# EAGLE schematic tiny-psu-exp-v1.1 (EAGLE 9.6.2)

## Sheet 1 of 2
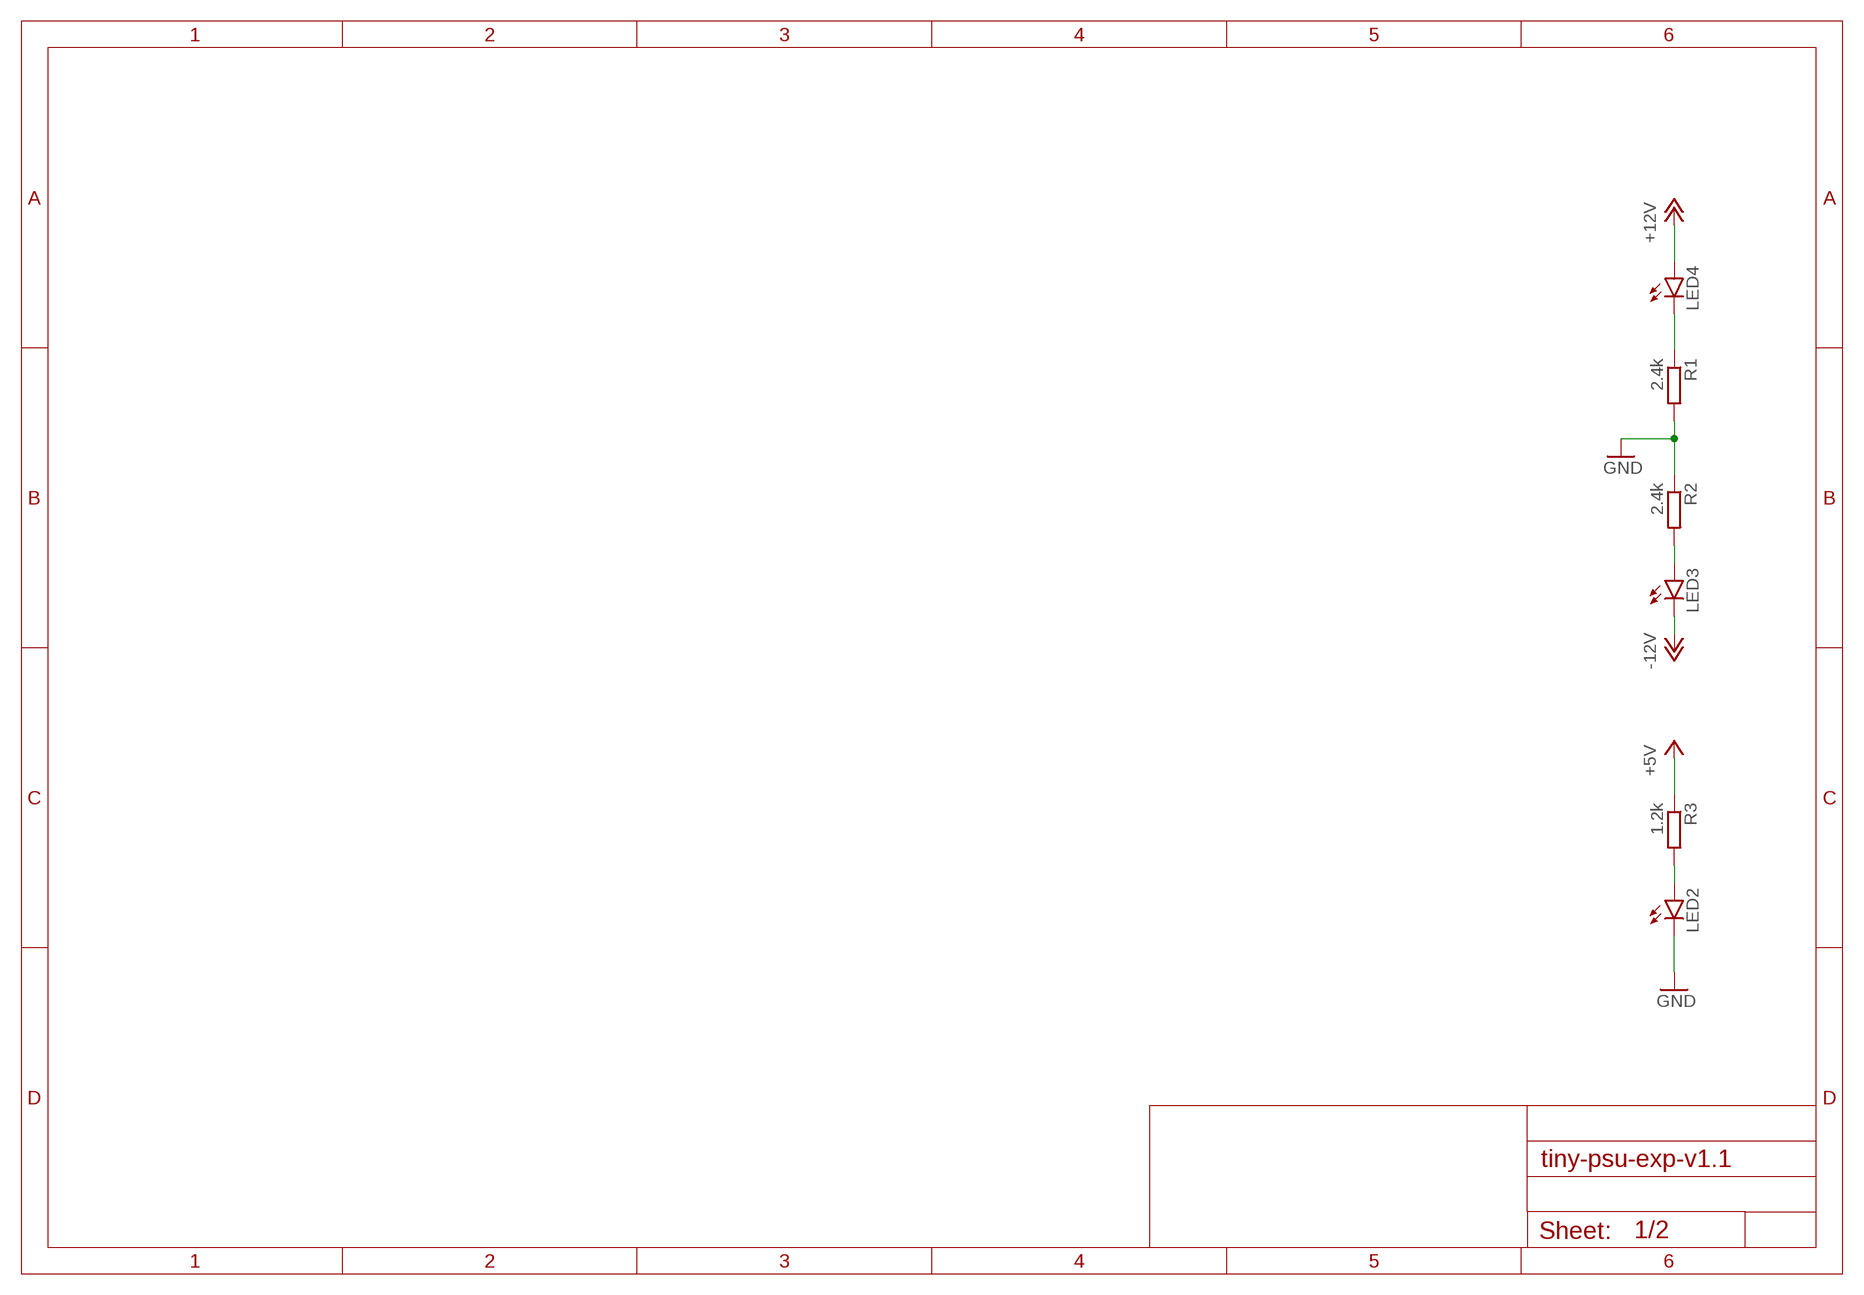
[diagram p0: schematic, sheet 1]

### Parts
LED2  LEDCHIP-LED0805  [CHIP-LED0805]
LED3  LEDCHIP-LED0805  [CHIP-LED0805]
LED4  LEDCHIP-LED0805  [CHIP-LED0805]
R1  2.4k  R-EU_R0805  [R0805]
R2  2.4k  R-EU_R0805  [R0805]
R3  1.2k  R-EU_R0805  [R0805]

### Nets
+5V: R3.1 ; also sheet 2
+12V: LED4.A ; also sheet 2
-12V: LED3.C ; also sheet 2
GND: LED2.C R1.2 R2.1 ; also sheet 2
N$1: LED4.C R1.1
N$3: LED3.A R2.2
N$10: LED2.A R3.2

## Sheet 2 of 2
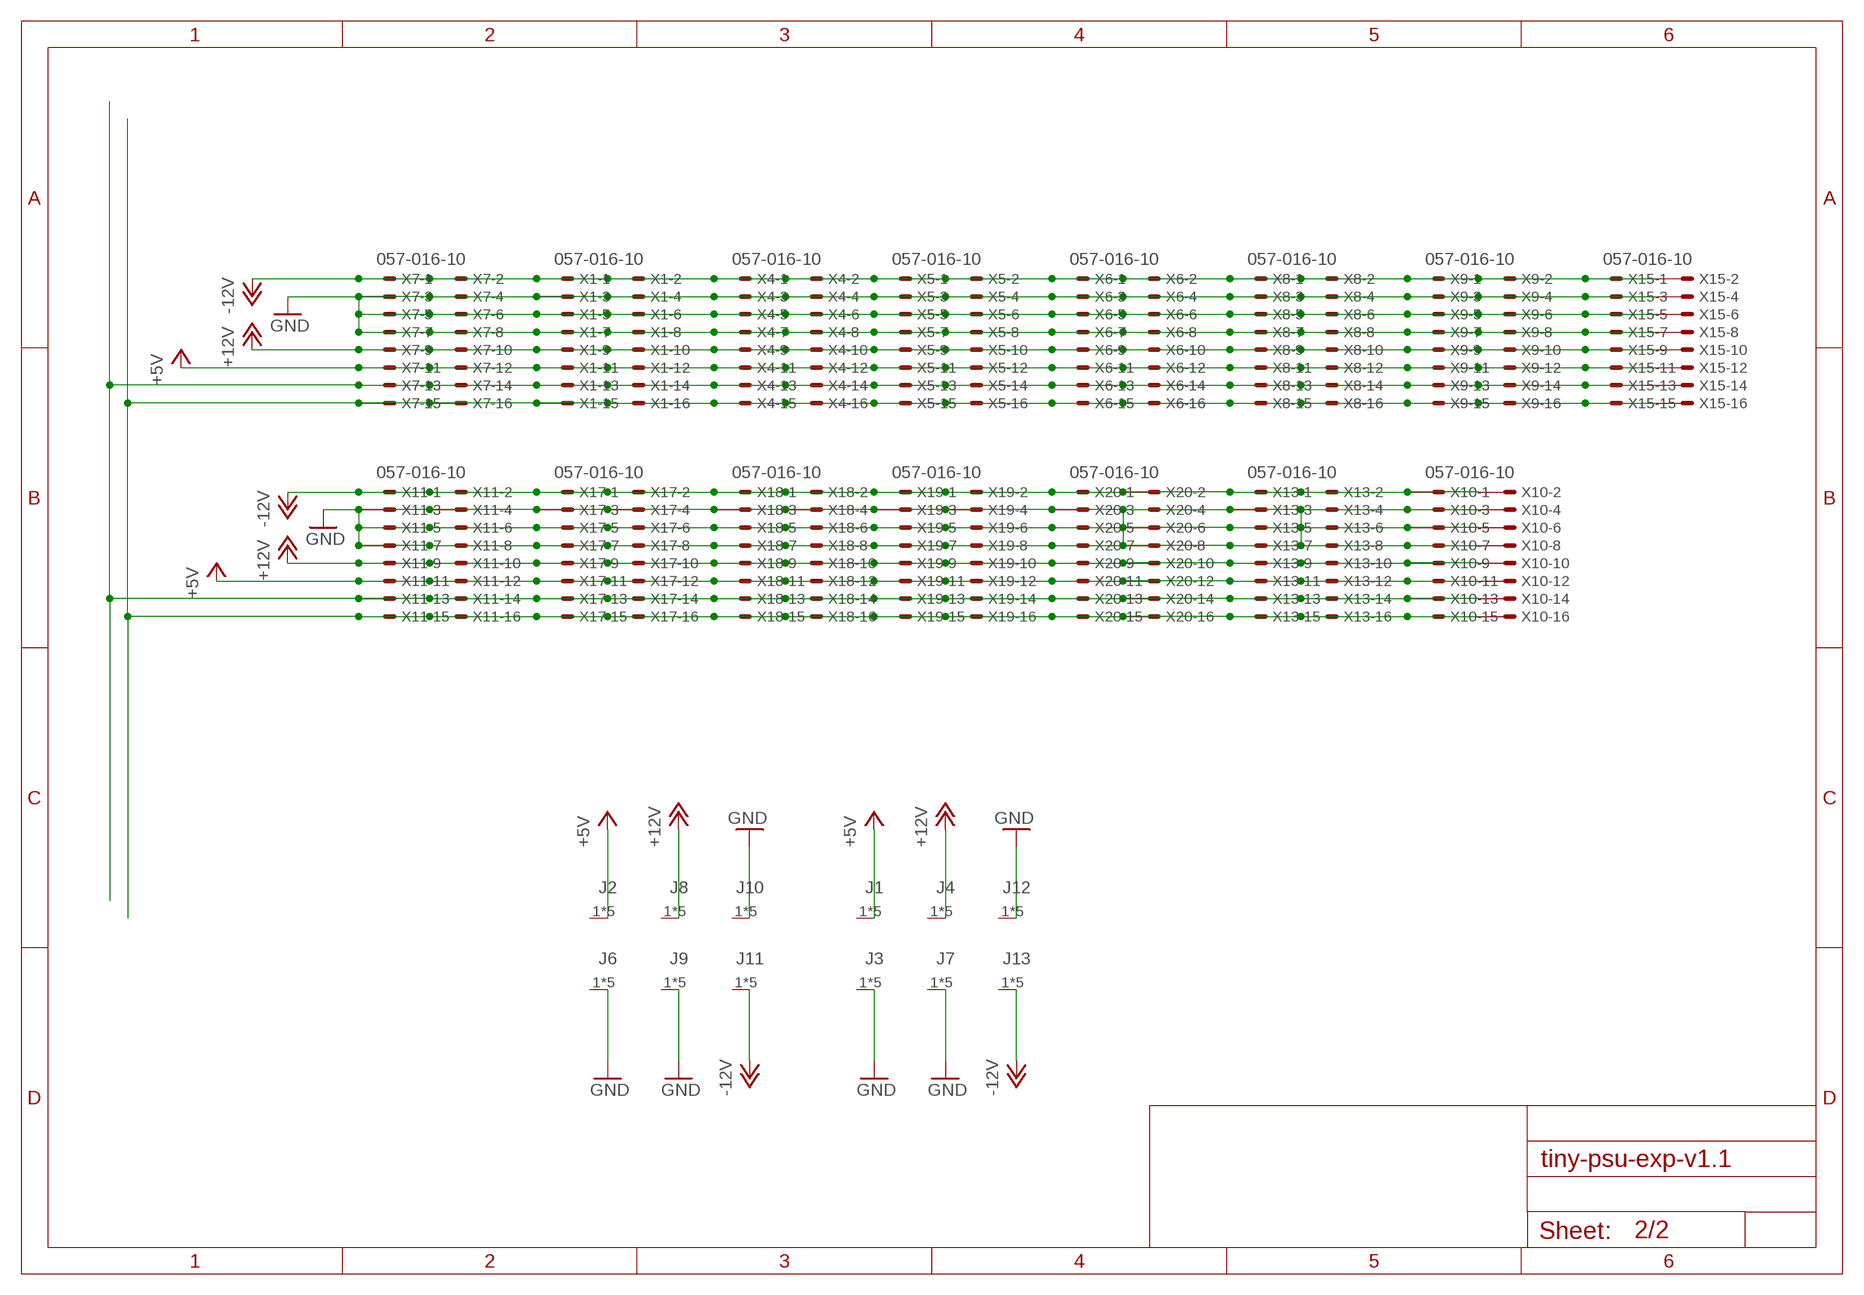
[diagram p1: schematic, sheet 2]

### Parts
J1  30A-SCREW-CONN  [50X72]
J2  30A-SCREW-CONN  [50X72]
J3  30A-SCREW-CONN  [50X72]
J4  30A-SCREW-CONN  [50X72]
J6  30A-SCREW-CONN  [50X72]
J7  30A-SCREW-CONN  [50X72]
J8  30A-SCREW-CONN  [50X72]
J9  30A-SCREW-CONN  [50X72]
J10  30A-SCREW-CONN  [50X72]
J11  30A-SCREW-CONN  [50X72]
J12  30A-SCREW-CONN  [50X72]
J13  30A-SCREW-CONN  [50X72]
X1  057-016-10  [057-016-1]
X4  057-016-10  [057-016-1]
X5  057-016-10  [057-016-1]
X6  057-016-10  [057-016-1]
X7  057-016-10  [057-016-1]
X8  057-016-10  [057-016-1]
X9  057-016-10  [057-016-1]
X10  057-016-10  [057-016-1]
X11  057-016-10  [057-016-1]
X13  057-016-10  [057-016-1]
X15  057-016-10  [057-016-1]
X17  057-016-10  [057-016-1]
X18  057-016-10  [057-016-1]
X19  057-016-10  [057-016-1]
X20  057-016-10  [057-016-1]

### Nets
+5V: J1.1 J1.2 J1.3 J1.4 J1.P$1 J2.1 J2.2 J2.3 J2.4 J2.P$1 X1.11 X1.12 X4.11 X4.12 X5.11 X5.12 X6.11 X6.12 X7.11 X7.12 X8.11 X8.12 X9.11 X9.12 X10.11 X10.12 X11.11 X11.12 X13.11 X13.12 X15.11 X15.12 X17.11 X17.12 X18.11 X18.12 X19.11 X19.12 X20.11 X20.12 ; also sheet 1
+12V: J4.1 J4.2 J4.3 J4.4 J4.P$1 J8.1 J8.2 J8.3 J8.4 J8.P$1 X1.9 X1.10 X4.9 X4.10 X5.9 X5.10 X6.9 X6.10 X7.9 X7.10 X8.9 X8.10 X9.9 X9.10 X10.9 X10.10 X11.9 X11.10 X13.9 X13.10 X15.9 X15.10 X17.9 X17.10 X18.9 X18.10 X19.9 X19.10 X20.9 X20.10 ; also sheet 1
-12V: J11.1 J11.2 J11.3 J11.4 J11.P$1 J13.1 J13.2 J13.3 J13.4 J13.P$1 X1.1 X1.2 X4.1 X4.2 X5.1 X5.2 X6.1 X6.2 X7.1 X7.2 X8.1 X8.2 X9.1 X9.2 X10.1 X10.2 X11.1 X11.2 X13.1 X13.2 X15.1 X15.2 X17.1 X17.2 X18.1 X18.2 X19.1 X19.2 X20.1 X20.2 ; also sheet 1
CV1: X1.13 X1.14 X4.13 X4.14 X5.13 X5.14 X6.13 X6.14 X7.13 X7.14 X8.13 X8.14 X9.13 X9.14 X10.13 X10.14 X11.13 X11.14 X13.13 X13.14 X15.13 X15.14 X17.13 X17.14 X18.13 X18.14 X19.13 X19.14 X20.13 X20.14
GATE1: X1.15 X1.16 X4.15 X4.16 X5.15 X5.16 X6.15 X6.16 X7.15 X7.16 X8.15 X8.16 X9.15 X9.16 X10.15 X10.16 X11.15 X11.16 X13.15 X13.16 X15.15 X15.16 X17.15 X17.16 X18.15 X18.16 X19.15 X19.16 X20.15 X20.16
GND: J3.1 J3.2 J3.3 J3.4 J3.P$1 J6.1 J6.2 J6.3 J6.4 J6.P$1 J7.1 J7.2 J7.3 J7.4 J7.P$1 J9.1 J9.2 J9.3 J9.4 J9.P$1 J10.1 J10.2 J10.3 J10.4 J10.P$1 J12.1 J12.2 J12.3 J12.4 J12.P$1 X1.3 X1.4 X1.5 X1.6 X1.7 X1.8 X4.3 X4.4 X4.5 X4.6 X4.7 X4.8 X5.3 X5.4 X5.5 X5.6 X5.7 X5.8 X6.3 X6.4 X6.5 X6.6 X6.7 X6.8 X7.3 X7.4 X7.5 X7.6 X7.7 X7.8 X8.3 X8.4 X8.5 X8.6 X8.7 X8.8 X9.3 X9.4 X9.5 X9.6 X9.7 X9.8 X10.3 X10.4 X10.5 X10.6 X10.7 X10.8 X11.3 X11.4 X11.5 X11.6 X11.7 X11.8 X13.3 X13.4 X13.5 X13.6 X13.7 X13.8 X15.3 X15.4 X15.5 X15.6 X15.7 X15.8 X17.3 X17.4 X17.5 X17.6 X17.7 X17.8 X18.3 X18.4 X18.5 X18.6 X18.7 X18.8 X19.3 X19.4 X19.5 X19.6 X19.7 X19.8 X20.3 X20.4 X20.5 X20.6 X20.7 X20.8 ; also sheet 1

## Library data of the parts
J1-J4 J6-J13 = conn-screw:30A-SCREW-CONN
LED2-LED4 = led:LED: LED OSRAM: - CHIPLED LG R971, LG N971, LY N971, LG Q971, LY Q971, LO R971, LY R971 LH N974, LH R974 LS Q976, LO Q976, LY Q976 LO Q996 - Hyper CHIPLED LW Q18S LB Q993, LB Q99A, LB R99A - SideLED LS A670, LO A670, LY A670, LG A670, LP A670 LB A673, LV A673, LT A673, LW A673 LH A674 LY A675 LS A676, LA A676, LO A676, LY A676, LW A676 LS A679, LY A679, LG A679 - Hyper Micro SIDELED® LS Y876, LA Y876, LO Y876, LY Y876 LT Y87S - SmartLED LW L88C, LW L88S LB L89C, LB L89S, LG L890 LS L89K, LO L89K, LY L89K LS L896, LA L896, LO L896, LY L896 - TOPLED LS T670, LO T670, LY T670, LG T670, LP T670 LSG T670, LSP T670, LSY T670, LOP T670, LYG T670 LG T671, LOG T671, LSG T671 LB T673, LV T673, LT T673, LW T673 LH T674 LS T676, LA T676, LO T676, LY T676, LB T676, LH T676, LSB T676, LW T676 LB T67C, LV T67C, LT T67C, LS T67K, LO T67K, LY T67K, LW E67C LS E67B, LA E67B, LO E67B, LY E67B, LB E67C, LV E67C, LT E67C LW T67C LS T679, LY T679, LG T679 LS T770, LO T770, LY T770, LG T770, LP T770 LB T773, LV T773, LT T773, LW T773 LH T774 LS E675, LA E675, LY E675, LS T675 LS T776, LA T776, LO T776, LY T776, LB T776 LHGB T686 LT T68C, LB T68C - Hyper Mini TOPLED® LB M676 - Mini TOPLED Santana® LG M470 LS M47K, LO M47K, LY M47K Source: http://www.osram.convergy.de LUXEON: - LUMILED® LXK2-PW12-R00, LXK2-PW12-S00, LXK2-PW14-U00, LXK2-PW14-V00 LXK2-PM12-R00, LXK2-PM12-S00, LXK2-PM14-U00 LXK2-PE12-Q00, LXK2-PE12-R00, LXK2-PE12-S00, LXK2-PE14-T00, LXK2-PE14-U00 LXK2-PB12-K00, LXK2-PB12-L00, LXK2-PB12-M00, LXK2-PB14-N00, LXK2-PB14-P00, LXK2-PB14-Q00 LXK2-PR12-L00, LXK2-PR12-M00, LXK2-PR14-Q00, LXK2-PR14-R00 LXK2-PD12-Q00, LXK2-PD12-R00, LXK2-PD12-S00 LXK2-PH12-R00, LXK2-PH12-S00 LXK2-PL12-P00, LXK2-PL12-Q00, LXK2-PL12-R00 Source: www.luxeon.com KINGBRIGHT: KA-3528ASYC Source: www.kingbright.com
R1-R3 = rcl:R-EU_: RESISTOR, European symbol; SPICEPREFIX: R
X1 X4-X11 X13 X15 X17-X20 = conn-fc:057-016-1: CONNECTOR 10-pin series 057 contact pc board low profile headers; OC_FARNELL: unknown; OC_NEWARK: unknown